# EasyEDA schematic SCH_MSX nano mouse v0.4_2024-05-15.json
TITLE: Sheet_1; REV: 1.0; Date: 2021-08-01; Sheet: 1/1; Drawn By: chiptune; Company: Your Company
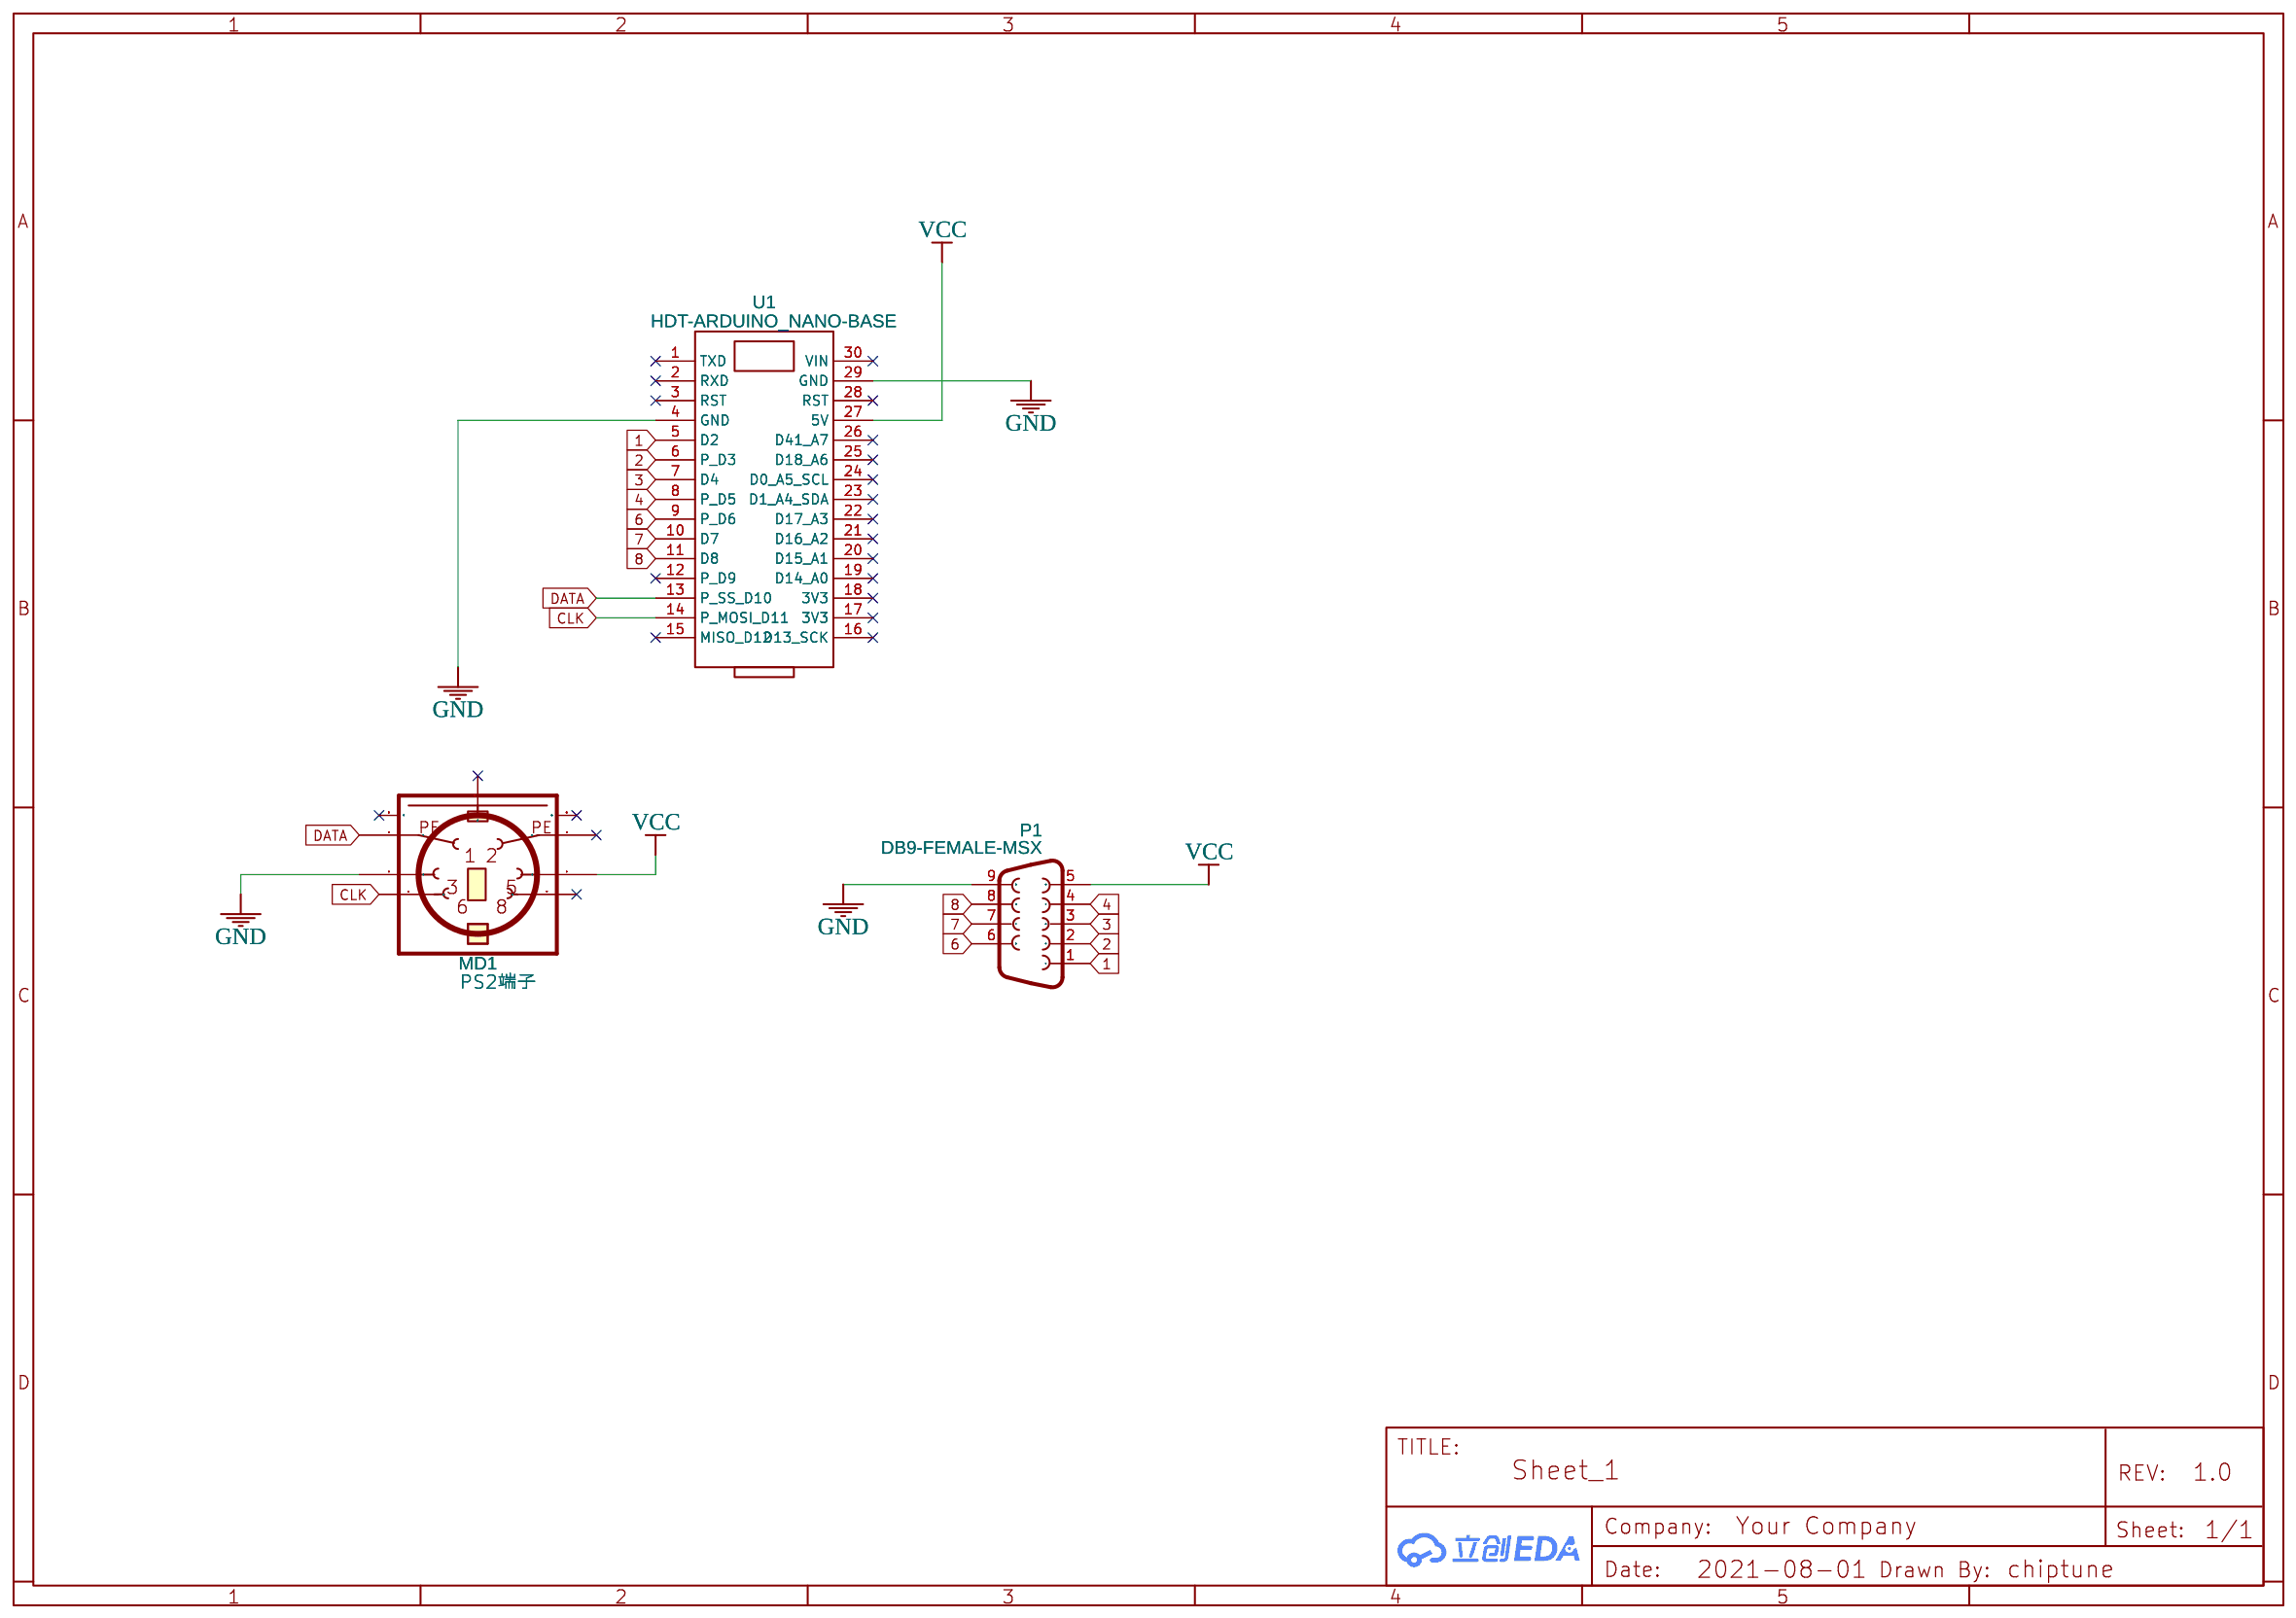
[diagram p0: schematic sheet]

## Parts
MD1  PS2端子  [M_DIN6-DJ]
P1  DB9-FEMALE-MSX  [DB9-FEMALE-MSX]
U1  HDT-ARDUINO_NANO-BASE  [ARDUINO_NANO]

## Library data of the parts
MD1 = PS2端子: Contributor: LCSC; Supplier: LCSC; Supplier Part: C2926814; Manufacturer: 华宇创; Manufacturer Part: HYC03-MDC603-128B; JLCPCB Part Class: Extended Part
P1 = DB9-FEMALE-MSX: Contributor: denjhang
U1 = HDT-ARDUINO_NANO-BASE: Manufacturer Part: arduino-nano; Supplier Part: undefined; Supplier: addNewSupplier; Contributor: geokai

## Nets
GND: MD1.3 P1.9 U1.4(GND) U1.29(GND)
VCC: MD1.5 P1.5 U1.27(5V)
1: P1.1 U1.5(D2)
2: P1.2 U1.6(P D3)
3: P1.3 U1.7(D4)
4: P1.4 U1.8(P D5)
6: P1.6 U1.9(P D6)
7: P1.7 U1.10(D7)
8: P1.8 U1.11(D8)
CLK: MD1.6 U1.14(P MOSI D11)
DATA: MD1.1 U1.13(P SS D10)

Not connected (* = marked no-connect by the designer): MD1 2* 8* SH1(PE1)* SH2(PE2)* SH3(PE3)*; U1 1(TXD)* 2(RXD)* 3(RST)* 12(P D9)* 15(MISO D12)* 16(D13 SCK)* 17(3V3)* 18(3V3)* 19(D14 A0)* 20(D15 A1)* 21(D16 A2)* 22(D17 A3)* 23(D1 A4 SDA)* 24(D0 A5 SCL)* 25(D18 A6)* 26(D41 A7)* 28(RST)* 30(VIN)*
